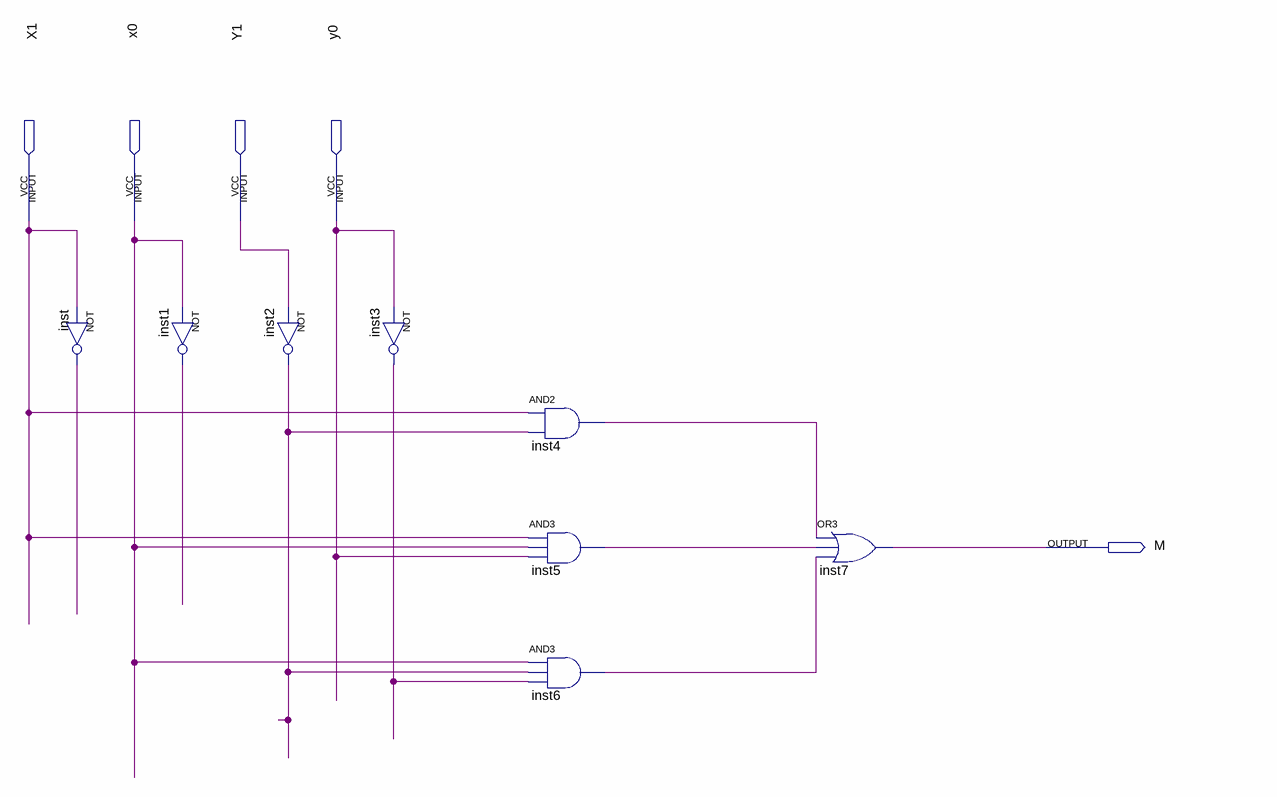
[diagram p0: schematic sheet]
// Quartus schematic testepramanha.bdf as structural Verilog: 8 symbols, 5 pins
module testepramanha (
  input  X1,
  input  x0,
  input  Y1,
  input  y0,
  output M
);

  wire inst1_out, inst2_out, inst3_out, inst4_out, inst5_out, inst6_out, inst_out;

  not inst (inst_out, X1);
  not inst1 (inst1_out, x0);
  not inst2 (inst2_out, Y1);
  not inst3 (inst3_out, y0);
  and inst4 (inst4_out, X1, inst2_out);
  and inst5 (inst5_out, X1, x0, y0);
  and inst6 (inst6_out, x0, inst2_out, inst3_out);
  or inst7 (M, inst4_out, inst5_out, inst6_out);
endmodule
